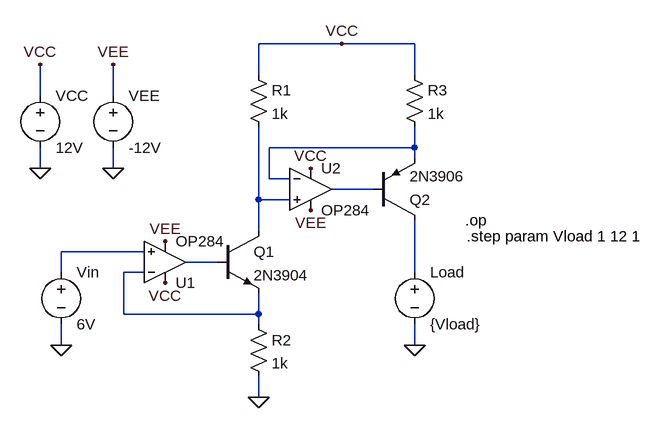
[diagram p0: schematic Figure4.11.asc]
Figure4.11.asc, the LTspice schematic file:
Version 4
SHEET 1 880 680
WIRE 352 -96 224 -96
WIRE 464 -96 352 -96
WIRE 224 -48 224 -96
WIRE 464 -48 464 -96
WIRE -112 -16 -112 -64
WIRE 0 -16 0 -64
WIRE 464 64 464 32
WIRE 464 64 240 64
WIRE 464 80 464 64
WIRE -112 96 -112 64
WIRE 0 96 0 64
WIRE 240 112 240 64
WIRE 272 112 240 112
WIRE 400 128 336 128
WIRE 224 144 224 32
WIRE 272 144 224 144
WIRE 224 192 224 144
WIRE 48 224 -80 224
WIRE 160 240 112 240
WIRE -80 256 -80 224
WIRE 48 256 16 256
WIRE 464 256 464 176
WIRE 16 320 16 256
WIRE 224 320 224 288
WIRE 224 320 16 320
WIRE 224 336 224 320
WIRE -80 368 -80 336
WIRE 464 368 464 336
WIRE 224 448 224 416
FLAG 224 448 0
FLAG -80 368 0
FLAG -112 96 0
FLAG 0 96 0
FLAG 464 368 0
FLAG -112 -64 VCC
FLAG 352 -96 VCC
FLAG 304 96 VCC
FLAG 80 272 VCC
FLAG 0 -64 VEE
FLAG 80 208 VEE
FLAG 304 160 VEE
SYMBOL OpAmps\\OP284 80 304 M180
SYMATTR InstName U1
SYMBOL OpAmps\\OP284 304 64 R0
SYMATTR InstName U2
SYMBOL npn 160 192 R0
SYMATTR InstName Q1
SYMATTR Value 2N3904
SYMBOL res 208 -64 R0
SYMATTR InstName R1
SYMATTR Value 1k
SYMBOL res 208 320 R0
SYMATTR InstName R2
SYMATTR Value 1k
SYMBOL res 448 -64 R0
SYMATTR InstName R3
SYMATTR Value 1k
SYMBOL pnp 400 176 M180
SYMATTR InstName Q2
SYMATTR Value 2N3906
SYMBOL voltage -112 -32 R0
WINDOW 123 0 0 Left 0
WINDOW 39 0 0 Left 0
SYMATTR InstName VCC
SYMATTR Value 12V
SYMBOL voltage 0 -32 R0
WINDOW 123 0 0 Left 0
WINDOW 39 0 0 Left 0
SYMATTR InstName VEE
SYMATTR Value -12V
SYMBOL voltage -80 240 R0
WINDOW 123 0 0 Left 0
WINDOW 39 0 0 Left 0
SYMATTR InstName Vin
SYMATTR Value 6V
SYMBOL voltage 464 240 R0
WINDOW 123 0 0 Left 0
WINDOW 39 0 0 Left 0
SYMATTR InstName Load
SYMATTR Value {Vload}
TEXT 542 176 Left 2 !.op
TEXT 544 200 Left 2 !.step param Vload 1 12 1

The netlist it stands for:
* Figure4.11.asc
XU1 N004 N006 VCC VEE N005 OP284  ; pins In+ In- V+ V- OUT
XU2 N003 N001 VCC VEE N002 OP284  ; pins In+ In- V+ V- OUT
Q1 N003 N005 N006 0 2N3904
R1 VCC N003 1k
R2 N006 0 1k
R3 VCC N001 1k
Q2 N007 N002 N001 0 2N3906
VCC VCC 0 12V
VEE VEE 0 -12V
Vin N004 0 6V
V§Load N007 0 {Vload}
.model NPN NPN
.model PNP PNP
.lib standard.bjt
.op
.step param Vload 1 12 1
.lib ADI1.lib
.backanno
.end